# EAGLE schematic Link232-wifi (EAGLE 9.6.2)
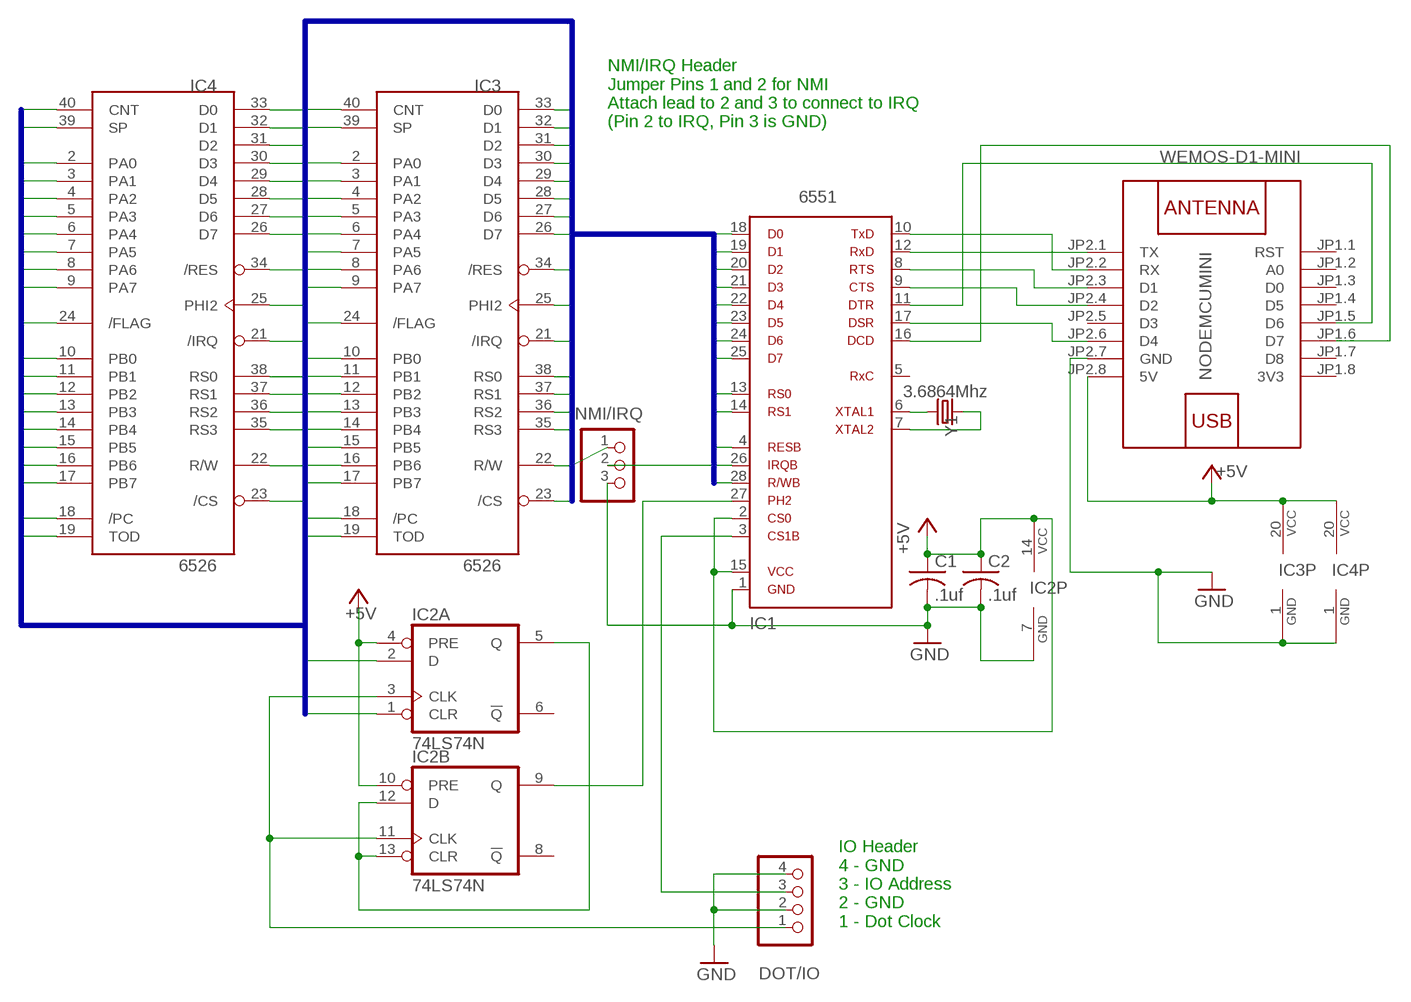
[diagram p0: schematic, sheet 1]

## Parts
C1  .1uf  C-US050-024X044  [C050-024X044]
C2  .1uf  C-US050-024X044  [C050-024X044]
DOT/IO  PINHD-1X4  [1X04]
IC1  6551  [6551]
IC2  74LS74N  [DIL14]
IC3  6526  [DIP40]
IC4  6526  [DIP40]
JP1  NMI/IRQ  PINHD-1X3  [1X03]
NODEMCUMINI  WEMOS-D1-MINI  [WEMOS-D1-MINI]
Y1  3.6864Mhz  CRYSTALPTH-HC49US  [HC49US]

## Nets
+5V: C1.1 C2.1 IC1.2 IC1.15 IC2.4(A:PRE) IC2.10(B:PRE) IC2.14(P:VCC) IC3.20(VCC) IC4.20(VCC) NODEMCUMINI.JP2.8(5V)
/CS: IC3.23(/CS) IC4.23(/CS)
/FLAG: IC3.24(/FLAG) IC4.24(/FLAG)
/PC: IC3.18(/PC) IC4.18(/PC)
CNT: IC3.40(CNT) IC4.40(CNT)
D0: IC1.18 IC3.33(D0) IC4.33(D0)
D1: IC1.19 IC3.32(D1) IC4.32(D1)
D2: IC1.20 IC3.31(D2) IC4.31(D2)
D3: IC1.21 IC3.30(D3) IC4.30(D3)
D4: IC1.22 IC3.29(D4) IC4.29(D4)
D5: IC1.23 IC3.28(D5) IC4.28(D5)
D6: IC1.24 IC3.27(D6) IC4.27(D6)
D7: IC1.25 IC3.26(D7) IC4.26(D7)
GND: C1.2 C2.2 DOT/IO.2 DOT/IO.4 IC1.1 IC2.7(P:GND) IC3.1(GND) IC4.1(GND) JP1.3 NODEMCUMINI.JP2.7(GND)
IRQ: IC3.21(/IRQ) IC4.21(/IRQ) JP1.1
N$1: DOT/IO.1 IC2.3(A:CLK) IC2.11(B:CLK)
N$2: IC2.5(A:Q) IC2.12(B:D) IC2.13(B:CLR)
N$3: IC1.27 IC2.9(B:Q)
N$4: IC1.26 JP1.2
N$5: DOT/IO.3 IC1.3
N$9: IC1.6 Y1.2
N$10: IC1.7 Y1.1
N$11: IC1.12 NODEMCUMINI.JP2.1(TX)
N$12: IC1.10 NODEMCUMINI.JP2.2(RX)
N$13: IC1.8 NODEMCUMINI.JP2.3(D1)
N$14: IC1.9 NODEMCUMINI.JP2.4(D2)
N$15: IC1.17 NODEMCUMINI.JP2.6(D4)
N$16: IC1.11 NODEMCUMINI.JP1.5(D6)
N$17: IC1.16 NODEMCUMINI.JP1.6(D7)
PA0: IC3.2(PA0) IC4.2(PA0)
PA1: IC3.3(PA1) IC4.3(PA1)
PA2: IC3.4(PA2) IC4.4(PA2)
PA3: IC3.5(PA3) IC4.5(PA3)
PA4: IC3.6(PA4) IC4.6(PA4)
PA5: IC3.7(PA5) IC4.7(PA5)
PA6: IC3.8(PA6) IC4.8(PA6)
PA7: IC3.9(PA7) IC4.9(PA7)
PB0: IC3.10(PB0) IC4.10(PB0)
PB1: IC3.11(PB1) IC4.11(PB1)
PB2: IC3.12(PB2) IC4.12(PB2)
PB3: IC3.13(PB3) IC4.13(PB3)
PB4: IC3.14(PB4) IC4.14(PB4)
PB5: IC3.15(PB5) IC4.15(PB5)
PB6: IC3.16(PB6) IC4.16(PB6)
PB7: IC3.17(PB7) IC4.17(PB7)
PHI2: IC2.1(A:CLR) IC2.2(A:D) IC3.25(PHI2) IC4.25(PHI2)
RES: IC1.4 IC3.34(/RES) IC4.34(/RES)
RS0: IC1.13 IC3.38(RS0) IC4.38(RS0)
RS1: IC1.14 IC3.37(RS1) IC4.37(RS1)
RS2: IC3.36(RS2) IC4.36(RS2)
RS3: IC3.35(RS3) IC4.35(RS3)
RW: IC1.28 IC3.22(R/W) IC4.22(R/W)
SP: IC3.39(SP) IC4.39(SP)
TOD: IC3.19(TOD) IC4.19(TOD)
Unconnected: IC1.5 IC2.6(A:!Q) IC2.8(B:!Q) NODEMCUMINI.JP1.1(RST) NODEMCUMINI.JP1.2(A0) NODEMCUMINI.JP1.3(D0) NODEMCUMINI.JP1.4(D5) NODEMCUMINI.JP1.7(D8) NODEMCUMINI.JP2.5(D3)

## Buses
CNT,/CS,D0,D1,D2,D3,D4,D5,D6,D7,/FLAG,IRQ,PA0,PA1,PA2,PA3,PA4,PA5,PA6,PA7,PB0,PB1,PB2,PB3,PB4,PB5,PB6,PB7,/PC,PHI2,RES,RS0,RS1,RS2,RS3,RW,SP,TOD

## Notes on the sheet
- NMI/IRQ Header
  Jumper Pins 1 and 2 for NMI
  Attach lead to 2 and 3 to connect to IRQ
  (Pin 2 to IRQ, Pin 3 is GND)
- IO Header
  4 - GND
  3 - IO Address
  2 - GND
  1 - Dot Clock

## Power pins joined to a net without a drawn wire
3V3: NODEMCUMINI.JP1.8(3V3)

## Library data of the parts
C1 C2 = rcl:C-US: CAPACITOR, American symbol; SPICEPREFIX: C
DOT/IO = pinhead:PINHD-1X4: PIN HEADER
IC1 = 65xx:6551: Dual In Line
IC2 = 74xx-us:74*74: Dual D type positive edge triggered FLIP FLOP, preset and clear
IC3 IC4 = 0RB_65xx:6526: I/O device: two 8-bits ports, handshake lines, timers. Used in C64 and C128.
JP1 = pinhead:PINHD-1X3: PIN HEADER
NODEMCUMINI = diy-modules:WEMOS-D1-MINI: WEMOS D1 mini: Mini Wi-Fi Board based on ESP-8266 device More details can be found here: https://www.wemos.cc/product/d1-mini.html Click here to find device on ebay.com <http://www.ebay.com/sch/wemos+d1+mini+nodemcu>
Y1 = SparkFun-Clocks:CRYSTAL: Crystals (Generic) These are passive quartz crystals, which can be used as a clock source for a microcontroller. Crystal's are two-terminal devices. They require external "load" capacitors to generate an oscillating signal.